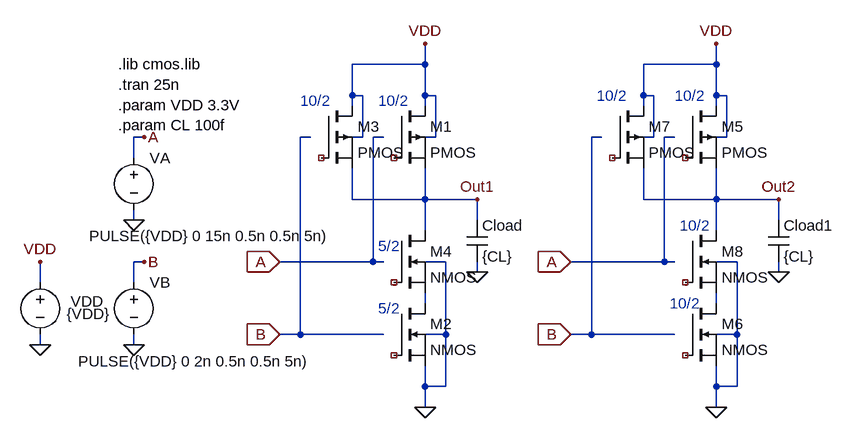
[diagram p0: schematic nand_tb.asc]
nand_tb.asc, the LTspice schematic file:
Version 4
SHEET 1 1292 680
WIRE -1088 -528 -1088 -560
WIRE -1088 -528 -1200 -528
WIRE -640 -528 -640 -560
WIRE -640 -528 -752 -528
WIRE -1200 -480 -1200 -528
WIRE -1184 -480 -1200 -480
WIRE -1088 -480 -1088 -528
WIRE -1072 -480 -1088 -480
WIRE -752 -480 -752 -528
WIRE -736 -480 -752 -480
WIRE -640 -480 -640 -528
WIRE -624 -480 -640 -480
WIRE -1200 -464 -1200 -480
WIRE -1088 -464 -1088 -480
WIRE -752 -464 -752 -480
WIRE -640 -464 -640 -480
WIRE -1520 -416 -1536 -416
WIRE -1264 -416 -1280 -416
WIRE -1184 -416 -1184 -480
WIRE -1184 -416 -1200 -416
WIRE -1152 -416 -1168 -416
WIRE -1072 -416 -1072 -480
WIRE -1072 -416 -1088 -416
WIRE -816 -416 -832 -416
WIRE -736 -416 -736 -480
WIRE -736 -416 -752 -416
WIRE -704 -416 -720 -416
WIRE -624 -416 -624 -480
WIRE -624 -416 -640 -416
WIRE -1536 -384 -1536 -416
WIRE -1200 -320 -1200 -368
WIRE -1088 -320 -1088 -368
WIRE -1088 -320 -1200 -320
WIRE -1008 -320 -1088 -320
WIRE -752 -320 -752 -368
WIRE -640 -320 -640 -368
WIRE -640 -320 -752 -320
WIRE -544 -320 -640 -320
WIRE -1536 -288 -1536 -304
WIRE -1008 -288 -1008 -320
WIRE -544 -288 -544 -320
WIRE -1088 -272 -1088 -320
WIRE -640 -272 -640 -320
WIRE -1520 -224 -1536 -224
WIRE -1168 -224 -1168 -416
WIRE -1168 -224 -1312 -224
WIRE -1152 -224 -1168 -224
WIRE -1056 -224 -1088 -224
WIRE -720 -224 -720 -416
WIRE -720 -224 -864 -224
WIRE -704 -224 -720 -224
WIRE -608 -224 -640 -224
WIRE -1008 -208 -1008 -224
WIRE -544 -208 -544 -224
WIRE -1680 -192 -1680 -224
WIRE -1536 -192 -1536 -224
WIRE -1088 -160 -1088 -176
WIRE -640 -160 -640 -176
WIRE -1280 -112 -1280 -416
WIRE -1280 -112 -1312 -112
WIRE -1152 -112 -1280 -112
WIRE -1056 -112 -1056 -224
WIRE -1056 -112 -1088 -112
WIRE -832 -112 -832 -416
WIRE -832 -112 -864 -112
WIRE -704 -112 -832 -112
WIRE -608 -112 -608 -224
WIRE -608 -112 -640 -112
WIRE -1680 -96 -1680 -112
WIRE -1536 -96 -1536 -112
WIRE -1088 -32 -1088 -64
WIRE -1056 -32 -1056 -112
WIRE -1056 -32 -1088 -32
WIRE -640 -32 -640 -64
WIRE -608 -32 -608 -112
WIRE -608 -32 -640 -32
WIRE -1088 0 -1088 -32
WIRE -640 0 -640 -32
FLAG -1680 -96 0
FLAG -1536 -96 0
FLAG -1536 -288 0
FLAG -1008 -320 Out1
FLAG -1680 -224 VDD
FLAG -1520 -416 A
FLAG -1520 -224 B
FLAG -1008 -208 0
FLAG -544 -320 Out2
FLAG -544 -208 0
FLAG -1088 0 0
FLAG -1088 -560 VDD
FLAG -1312 -224 A
IOPIN -1312 -224 In
FLAG -1312 -112 B
IOPIN -1312 -112 In
FLAG -640 0 0
FLAG -640 -560 VDD
FLAG -864 -224 A
IOPIN -864 -224 In
FLAG -864 -112 B
IOPIN -864 -112 In
SYMBOL voltage -1680 -208 R0
WINDOW 123 0 0 Left 2
WINDOW 39 0 0 Left 2
WINDOW 0 47 45 Left 2
WINDOW 3 41 64 Left 2
SYMATTR InstName VDD
SYMATTR Value {VDD}
SYMBOL cap -1024 -288 R0
SYMATTR InstName Cload
SYMATTR Value {CL}
SYMBOL voltage -1536 -208 R0
WINDOW 123 0 0 Left 2
WINDOW 39 0 0 Left 2
WINDOW 3 -86 137 Left 2
SYMATTR Value PULSE({VDD} 0 2n 0.5n 0.5n 5n)
SYMATTR InstName VB
SYMBOL voltage -1536 -400 R0
WINDOW 123 0 0 Left 2
WINDOW 39 0 0 Left 2
WINDOW 3 -69 136 Left 2
SYMATTR Value PULSE({VDD} 0 15n 0.5n 0.5n 5n)
SYMATTR InstName VA
SYMBOL cap -560 -288 R0
SYMATTR InstName Cload1
SYMATTR Value {CL}
SYMBOL pmos -1136 -464 R0
SYMATTR InstName M1
SYMATTR Value2 l=0.6u w=3u
SYMBOL nmos -1136 -160 R0
SYMATTR InstName M2
SYMATTR Value2 l=0.6u w=1.5u
SYMATTR SpiceModel ""
SYMATTR Value NMOS
SYMBOL pmos -1248 -464 R0
SYMATTR InstName M3
SYMATTR Value2 l=0.6u w=3u
SYMATTR SpiceModel ""
SYMATTR Value PMOS
SYMBOL nmos -1136 -272 R0
SYMATTR InstName M4
SYMATTR Value2 l=0.6u w=1.5u
SYMATTR SpiceModel ""
SYMATTR Value NMOS
SYMBOL pmos -688 -464 R0
SYMATTR InstName M5
SYMATTR Value2 l=0.6u w=3u
SYMBOL nmos -688 -160 R0
SYMATTR InstName M6
SYMATTR Value2 l=0.6u w=3u
SYMBOL pmos -800 -464 R0
SYMATTR InstName M7
SYMATTR Value2 l=0.6u w=3u
SYMATTR SpiceModel ""
SYMATTR Value PMOS
SYMBOL nmos -688 -272 R0
SYMATTR InstName M8
SYMATTR Value2 l=0.6u w=3u
SYMATTR SpiceModel ""
SYMATTR Value NMOS
TEXT -1560 -528 Left 2 !.lib cmos.lib\n.tran 25n\n.param VDD 3.3V\n.param CL 100f
TEXT -1160 -472 Left 2 ;10/2
TEXT -1280 -472 Left 2 ;10/2
TEXT -1160 -248 Left 2 ;5/2
TEXT -1160 -152 Left 2 ;5/2
TEXT -824 -480 Left 2 ;10/2
TEXT -704 -480 Left 2 ;10/2
TEXT -696 -280 Left 2 ;10/2
TEXT -712 -160 Left 2 ;10/2

The netlist it stands for:
* nand_tb.asc
VDD VDD 0 {VDD}
Cload Out1 0 {CL}
VB B 0 PULSE({VDD} 0 2n 0.5n 0.5n 5n)
VA A 0 PULSE({VDD} 0 15n 0.5n 0.5n 5n)
Cload1 Out2 0 {CL}
* M1: PMOS l=0.6u w=3u (symbol pmos not certain, pin order unknown); nets seen at it: Out1, VDD
* M2: NMOS l=0.6u w=1.5u (symbol nmos not certain, pin order unknown); nets seen at it: 0, N001
* M3: PMOS l=0.6u w=3u (symbol pmos not certain, pin order unknown); nets seen at it: Out1, VDD
* M4: NMOS l=0.6u w=1.5u (symbol nmos not certain, pin order unknown); nets seen at it: N001, Out1
* M5: PMOS l=0.6u w=3u (symbol pmos not certain, pin order unknown); nets seen at it: Out2, VDD
* M6: NMOS l=0.6u w=3u (symbol nmos not certain, pin order unknown); nets seen at it: 0, N002
* M7: PMOS l=0.6u w=3u (symbol pmos not certain, pin order unknown); nets seen at it: Out2, VDD
* M8: NMOS l=0.6u w=3u (symbol nmos not certain, pin order unknown); nets seen at it: N002, Out2
.lib cmos.lib
.tran 25n
.param VDD 3.3V
.param CL 100f
* 10/2
* 10/2
* 5/2
* 5/2
* 10/2
* 10/2
* 10/2
* 10/2
.backanno
.end